# EAGLE design RS485_v1 (EAGLE 6.1)
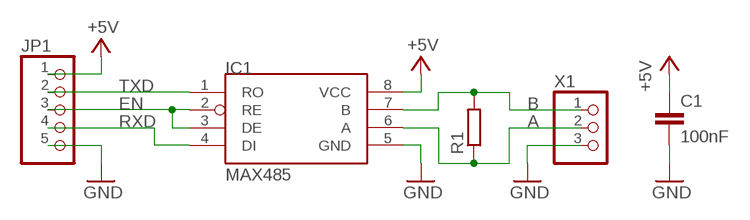
[diagram p0: schematic, sheet 1]

## Parts
C1  100nF  C-EUC0805K  [C0805K]
IC1  MAX485  [SO08]
JP1  PINHD-1X5  [1X05]
R1  R-EU_R0805  [R0805]
X1  W237-103  [W237-103]

## Nets
+5V: C1.1 IC1.8(VCC) JP1.1
A: IC1.6(A) R1.1 X1.2
B: IC1.7(B) R1.2 X1.1
EN: IC1.2(RE) IC1.3(DE) JP1.3
GND: C1.2 IC1.5(GND) JP1.5 X1.3
RXD: IC1.4(DI) JP1.4
TXD: IC1.1(RO) JP1.2

## Library data of the parts
C1 = mark_1:C-EU: CAPACITOR, European symbol
IC1 = mark_1:MAX485
JP1 = mark_1:PINHD-1X5: PIN HEADER
R1 = mark_1:R-EU_: RESISTOR, European symbol
X1 = mark_1:W237-103: WAGO SCREW CLAMP

## Board
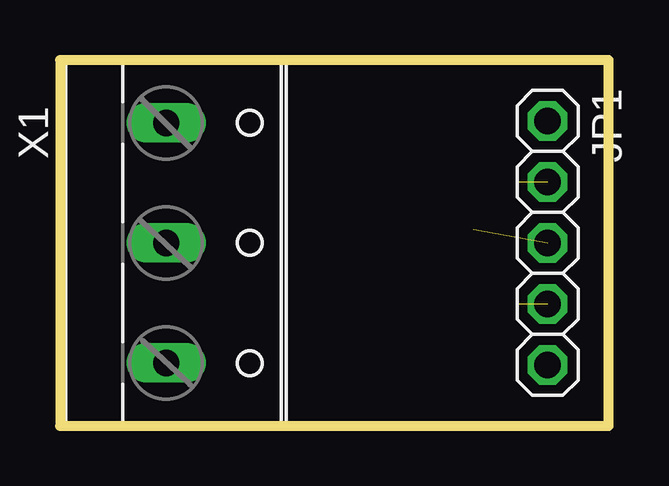
[diagram p1: board, top side]
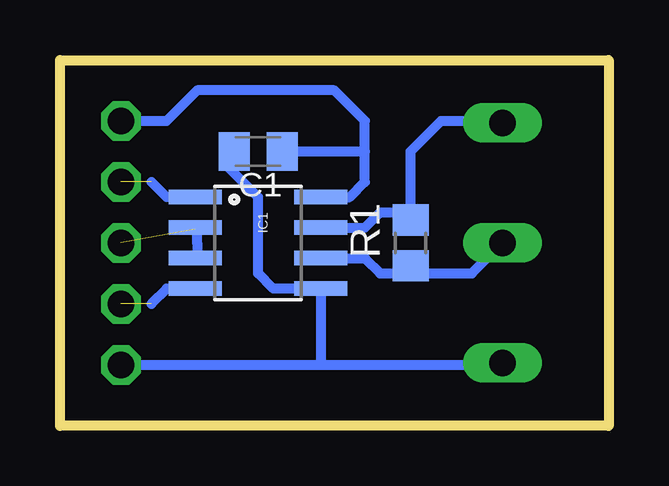
[diagram p2: board, bottom side, seen from below]

Size 22.86 x 15.24 mm. Coordinates in mm from the lower left corner, seen from the top.
Outline: 0,0 22.86,0 22.86,15.24 0,15.24 0,0
Copper layers (1*16): Top 0.035mm / dielectric 1.5mm / Bottom 0.035mm
Design rules: minimum track width 10mil, minimum drill 24mil, track to track 8mil, track to pad 8mil, pad to pad 8mil, via to via 8mil, smd to smd 8mil, copper to edge 40mil, drill to drill 8mil, minimum pad ring 10mil, minimum via ring 8mil, stop-mask expansion 4mil, vias tented up to drill 0mil, thermal gap 10mil

### Footprints (pad centres in the part's own frame; a part is rotated, then mirrored left to right if it is on the bottom)
C0805K = smd 1.3 x 1.6: 1 -1,0; 2 1,0
SO08 = smd 0.61 x 2.21: 1 -1.905,-2.616; 2 -0.635,-2.616; 3 0.635,-2.616; 4 1.905,-2.616; 5 1.905,2.616; 6 0.635,2.616; 7 -0.635,2.616; 8 -1.905,2.616
1X05 = drill 1.1 octagon: 1 -5.08,0; 2 -2.54,0; 3 0,0; 4 2.54,0; 5 5.08,0
R0805 = smd 1.3 x 1.5: 1 -0.95,0; 2 0.95,0
W237-103 = drill 1.1 long: 1 -5,-1.29; 2 0,-1.29; 3 5,-1.29

### Placement (x,y rotation side)
C1  14.61,11.43 180 bottom
IC1  14.61,7.62 270 bottom
JP1  20.32,7.62 270 top
R1  8.26,7.62 90 bottom
X1  5.71,7.62 270 top

### Tracks (layer width: path | path; a pad name or v marks a point on that pad's centre or on a via)
+5V
  Bottom 0.406: JP1.1 18.41,12.7 17.14,13.97 11.43,13.97 10.16,12.7 10.16,11.43 | IC1.8 10.79,9.53 10.16,10.16 10.16,11.43 | C1.1 10.16,11.43
A
  Bottom 0.406: IC1.6 10.16,6.99 9.53,6.35 8.57,6.35 R1.1 8.26,6.35 5.7,6.35 X1.2
B
  Bottom 0.406: IC1.7 10.16,8.26 9.53,8.89 8.57,8.89 R1.2 8.26,11.43 6.99,12.7 4.5,12.7 X1.1
EN  (1 unrouted)
  Bottom 0.406: 17.22,8.18 IC1.2 17.14,8.18 17.14,7.62 17.14,7.06 IC1.3
GND
  Bottom 0.406: JP1.5 12.06,2.54 | 12.06,2.54 4.5,2.54 X1.3 | 12.06,2.54 11.99,2.62 IC1.5 13.97,5.71 14.61,6.35 14.61,9.53 15.88,10.79 15.88,11.16 C1.2
RXD  (1 unrouted)
  Bottom 0.406: IC1.4 18.41,5.71 19.05,5.08
TXD  (1 unrouted)
  Bottom 0.406: IC1.1 18.41,9.53 19.05,10.16